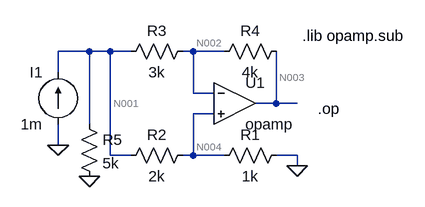
[diagram p0: schematic pag7es15p1.asc]
pag7es15p1.asc, the LTspice schematic file:
Version 4
SHEET 1 880 680
WIRE 64 32 16 32
WIRE 96 32 64 32
WIRE 128 32 96 32
WIRE 224 32 208 32
WIRE 272 32 224 32
WIRE 16 64 16 32
WIRE 224 96 224 32
WIRE 256 96 224 96
WIRE 352 112 352 32
WIRE 352 112 320 112
WIRE 384 112 352 112
WIRE 256 128 224 128
WIRE 64 144 64 32
WIRE 16 176 16 144
WIRE 96 192 96 32
WIRE 128 192 96 192
WIRE 224 192 224 128
WIRE 224 192 208 192
WIRE 272 192 224 192
WIRE 384 192 352 192
WIRE 384 208 384 192
FLAG 16 176 0
FLAG 384 208 0
FLAG 64 224 0
SYMBOL current 16 144 R180
WINDOW 0 24 80 Left 2
WINDOW 3 24 0 Left 2
SYMATTR InstName I1
SYMATTR Value 1m
SYMBOL res 224 176 R90
WINDOW 0 0 56 VBottom 2
WINDOW 3 32 56 VTop 2
SYMATTR InstName R2
SYMATTR Value 2k
SYMBOL res 368 176 R90
WINDOW 0 0 56 VBottom 2
WINDOW 3 32 56 VTop 2
SYMATTR InstName R1
SYMATTR Value 1k
SYMBOL res 224 16 R90
WINDOW 0 0 56 VBottom 2
WINDOW 3 32 56 VTop 2
SYMATTR InstName R3
SYMATTR Value 3k
SYMBOL res 368 16 R90
WINDOW 0 0 56 VBottom 2
WINDOW 3 32 56 VTop 2
SYMATTR InstName R4
SYMATTR Value 4k
SYMBOL OpAmps\\opamp 288 48 R0
SYMATTR InstName U1
SYMBOL res 48 128 R0
SYMATTR InstName R5
SYMATTR Value 5k
TEXT 392 8 Left 2 !.lib opamp.sub
TEXT 416 120 Left 2 !.op

The netlist it stands for:
* pag7es15p1.asc
I1 0 N001 1m
R2 N004 N001 2k
R1 0 N004 1k
R3 N002 N001 3k
R4 N003 N002 4k
XU1 N002 N004 N003 opamp Aol=100K GBW=10Meg  ; pins invin noninvin out
R5 N001 0 5k
.lib opamp.sub
.op
.backanno
.end

* Results of the author's LTspice run, read from the files saved beside the schematic
* Operating Point:
*   V(n001) = 1.324 V
*   V(n004) = 441.2 mV
*   V(n002) = 441.2 mV
*   V(n003) = -735.3 mV
*   I(I1) = 1 mA
*   I(R5) = 264.7 µA
*   I(R4) = -294.1 µA
*   I(R3) = -294.1 µA
*   I(R1) = -441.2 µA
*   I(R2) = -441.2 µA
*   Ix(u1:3) = 294.1 µA